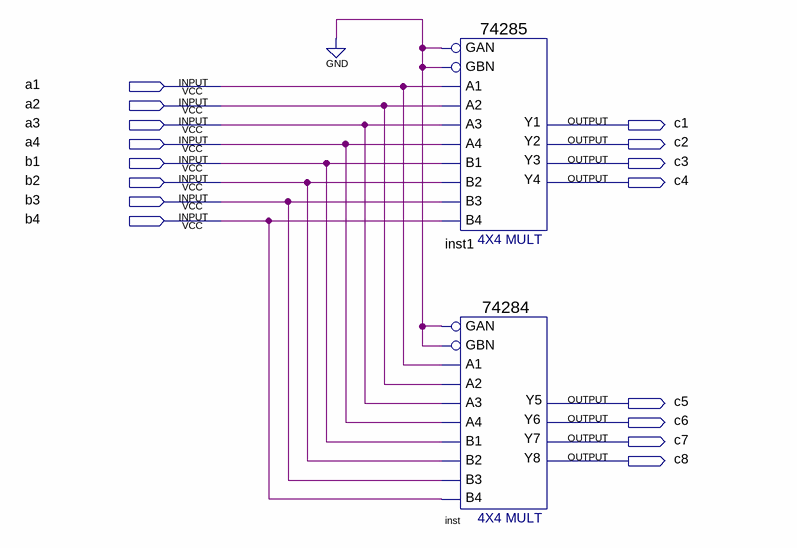
[diagram p0: schematic sheet]
// Quartus schematic MUL.bdf as structural Verilog: 2 symbols, 16 pins
module MUL (
  input  a1,
  input  a2,
  input  a3,
  input  a4,
  input  b1,
  input  b2,
  input  b3,
  input  b4,
  output c1,
  output c2,
  output c3,
  output c4,
  output c5,
  output c6,
  output c7,
  output c8
);

  \74285  inst1 (
    .GBN(1'b0), .GAN(1'b0), .A1(a1), .A2(a2), .A3(a3), .B2(b2), .B1(b1), .A4(a4), .B4(b4), .B3(b3), .Y4(c4),
    .Y1(c1), .Y2(c2), .Y3(c3));
  \74284  inst (
    .GAN(1'b0), .A2(a2), .A1(a1), .GBN(1'b0), .B1(b1), .A4(a4), .A3(a3), .B4(b4), .B3(b3), .B2(b2), .Y8(c8),
    .Y6(c6), .Y7(c7), .Y5(c5));
endmodule
